# Altium project kypca4_altium.PrjPcb
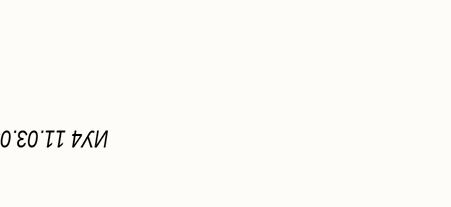
[diagram p0: schema.SchDoc, top left]
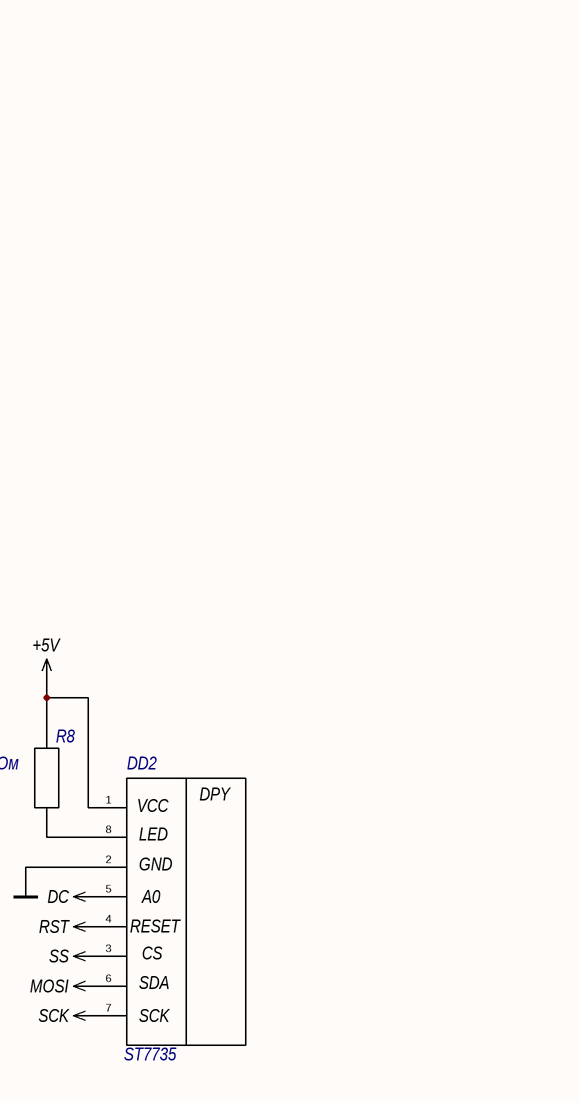
[diagram p1: schema.SchDoc, top right]
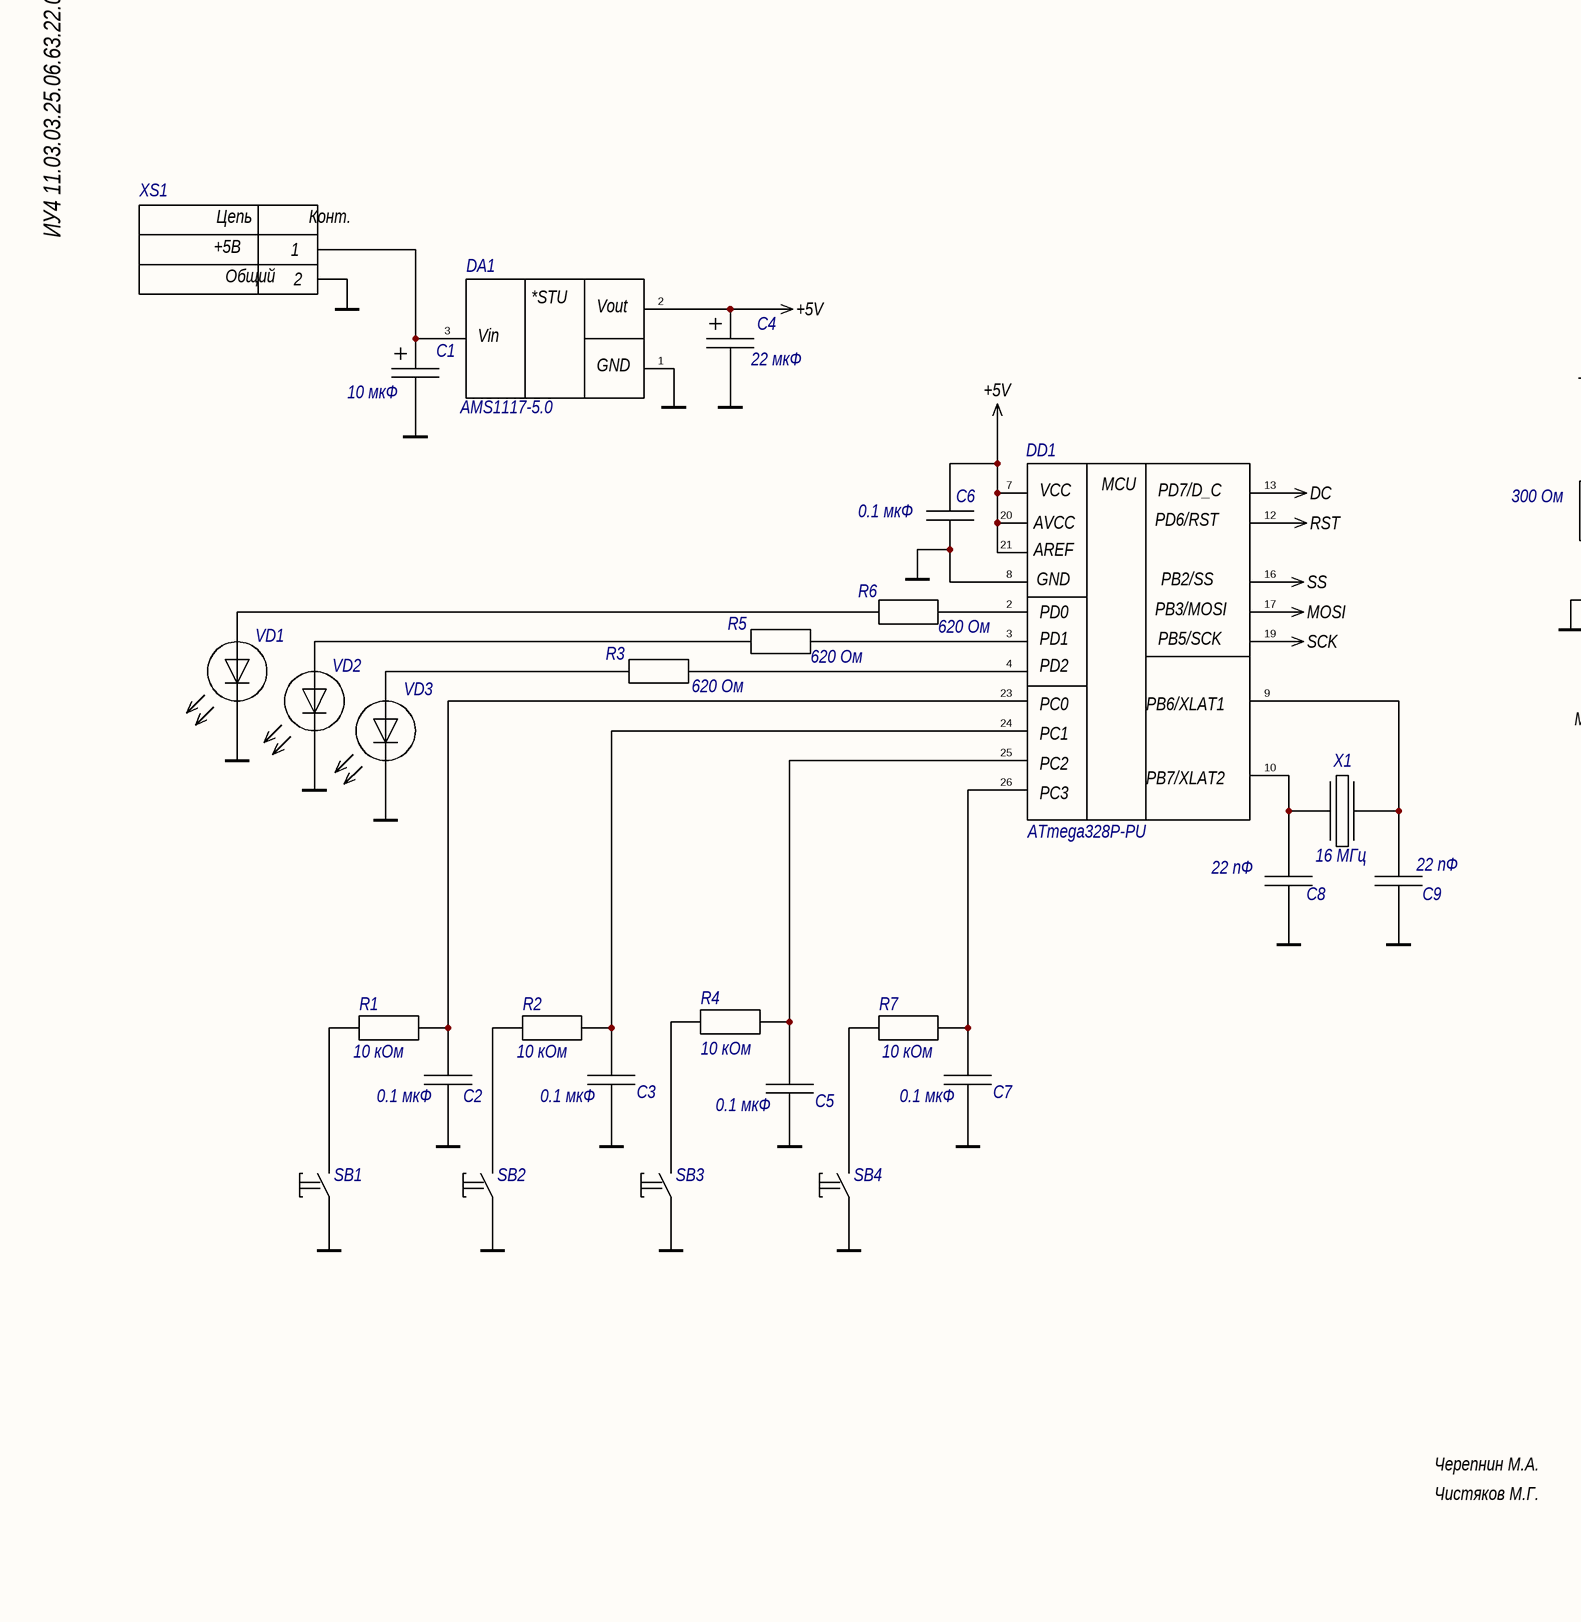
[diagram p2: schema.SchDoc, bottom left]
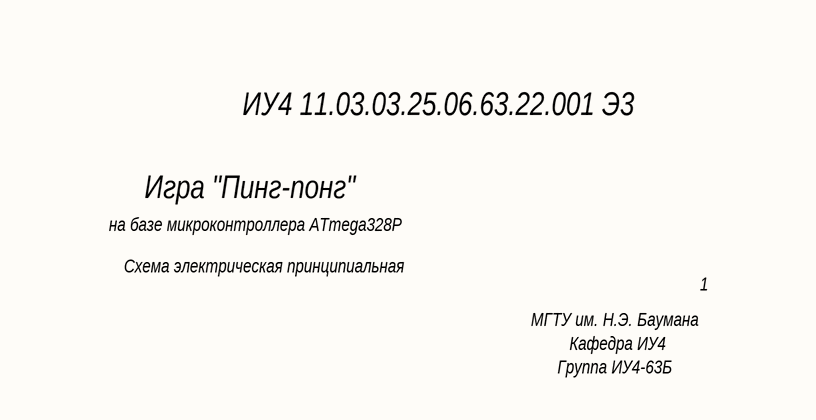
[diagram p3: schema.SchDoc, bottom right]
Папка для сохранения графической документации: Документация; Папка для сохранения текстовой документации: Документация
2 sheets, 29 parts. Net scope: global (net labels, ports and power ports of the same name join across sheets).
Board file: kursa4.PcbDoc
Sheets:
  schema.SchDoc
  E2.SchDoc

## Sheet schema.SchDoc
size 420 x 297 mm; Author: Черепнин М.А.; SheetNumber: 1; SheetTotal: 2

### Parts
C1  10 мкФ  [CE]
C2  0.1 мкФ  [СC]
C3  0.1 мкФ  [СC]
C4  22 мкФ  [CE]
C5  0.1 мкФ  [СC]
C6  0.1 мкФ  [СC]
C7  0.1 мкФ  [СC]
C8  22 пФ  [СC]
C9  22 пФ  [СC]
DA1  AMS1117-5.0  [SOT223]
DD1  ATmega328P-PU  [ATMEGA328P-PU]
DD2  ST7735  [LCD]
R1  10 кОм  [R]
R2  10 кОм  [R]
R3  620 Ом  [R]
R4  10 кОм  [R]
R5  620 Ом  [R]
R6  620 Ом  [R]
R7  10 кОм  [R]
R8  300 Ом  [R]
SB1  Button  [Button]  (value not drawn)
SB2  Button  [Button]  (value not drawn)
SB3  Button  [Button]  (value not drawn)
SB4  Button  [Button]  (value not drawn)
VD1  Led  [LED]  (value not drawn)
VD2  Led  [LED]  (value not drawn)
VD3  Led  [LED]  (value not drawn)
X1  16 МГц  [Quartz]
XS1  USB  [TypeC]  (value not drawn)

### Nets
+5V: C4.1 C6.2 DA1.2 DD1.7 DD1.20 DD1.21 DD2.1 R8.2
DC: DD1.13 DD2.5
GND: C1.2 C2.1 C3.1 C4.2 C5.1 C6.1 C7.1 C8.1 C9.1 DA1.1 DD1.8 DD2.2 SB1.1 SB2.1 SB3.1 SB4.1 VD1.1 VD2.1 VD3.1 XS1.GND
MOSI: DD1.17 DD2.6
RST: DD1.12 DD2.4
SCK: DD1.19 DD2.7
SS: DD1.16 DD2.3
NetC1_1: C1.1 DA1.3 XS1.VCC
NetC2_2: C2.2 DD1.23 R1.2
NetC3_2: C3.2 DD1.24 R2.2
NetC5_2: C5.2 DD1.25 R4.2
NetC7_2: C7.2 DD1.26 R7.2
NetC8_2: C8.2 DD1.10 X1.1
NetC9_2: C9.2 DD1.9 X1.2
NetDD1_2: DD1.2 R6.2
NetDD1_3: DD1.3 R5.2
NetDD1_4: DD1.4 R3.2
NetDD2_8: DD2.8 R8.1
NetR1_1: R1.1 SB1.2
NetR2_1: R2.1 SB2.2
NetR3_1: R3.1 VD3.2
NetR4_1: R4.1 SB3.2
NetR5_1: R5.1 VD2.2
NetR6_1: R6.1 VD1.2
NetR7_1: R7.1 SB4.2

### Notes on the sheet
- ИУ4 11.03.03.25.06.63.22.001 Э3
- ИУ4 11.03.03.25.06.63.22.001
- Игра "Пинг-понг"
- Черепнин М.А.
- Чистяков М.Г.
- на базе микроконтроллера ATmega328P
- Схема электрическая принципиальная
- 1
- МГТУ им. Н.Э. Баумана
- Группа ИУ4-63Б
- Кафедра ИУ4
- Перв.примен.
- Справ.№
- Подп. и дата
- Инв.№ дубл.
- Взам.инв.№
- Подп.и дата
- Разраб.
- Изм.
- Лист
- № докум.
- Подп.
- Дата
- Лит.
- Масштаб
- Масса
- Пров.
- Листов
- Инв.№ подл.
- (in symbol ATmega328P-PU) MCU; VCC; PD7/D_C; AVCC; PD6/RST; AREF; GND; PB2/SS; PD0; PB3/MOSI; PD1; PB5/SCK; PD2; PC0; PB6/XLAT1; PC1; PC2; PB7/XLAT2; PC3
- (in symbol LCD) DPY; VCC; LED; GND; A0; RESET; CS; SDA; SCK
- (in symbol Stabilizator) *STU; Vout; Vin; GND
- (in symbol USB) Цепь; Конт.; +5В; 1; Общий; 2

### Library data of the parts
C1 C4 = CE
C2 C3 C5-C9 = C
DA1 = Stabilizator
DD2 = LCD
R1-R8 = Resistor
VD1-VD3 = Led: RED
X1 = Quartz

## Sheet E2.SchDoc
size 420 x 297 mm; SheetNumber: 2; SheetTotal: 2
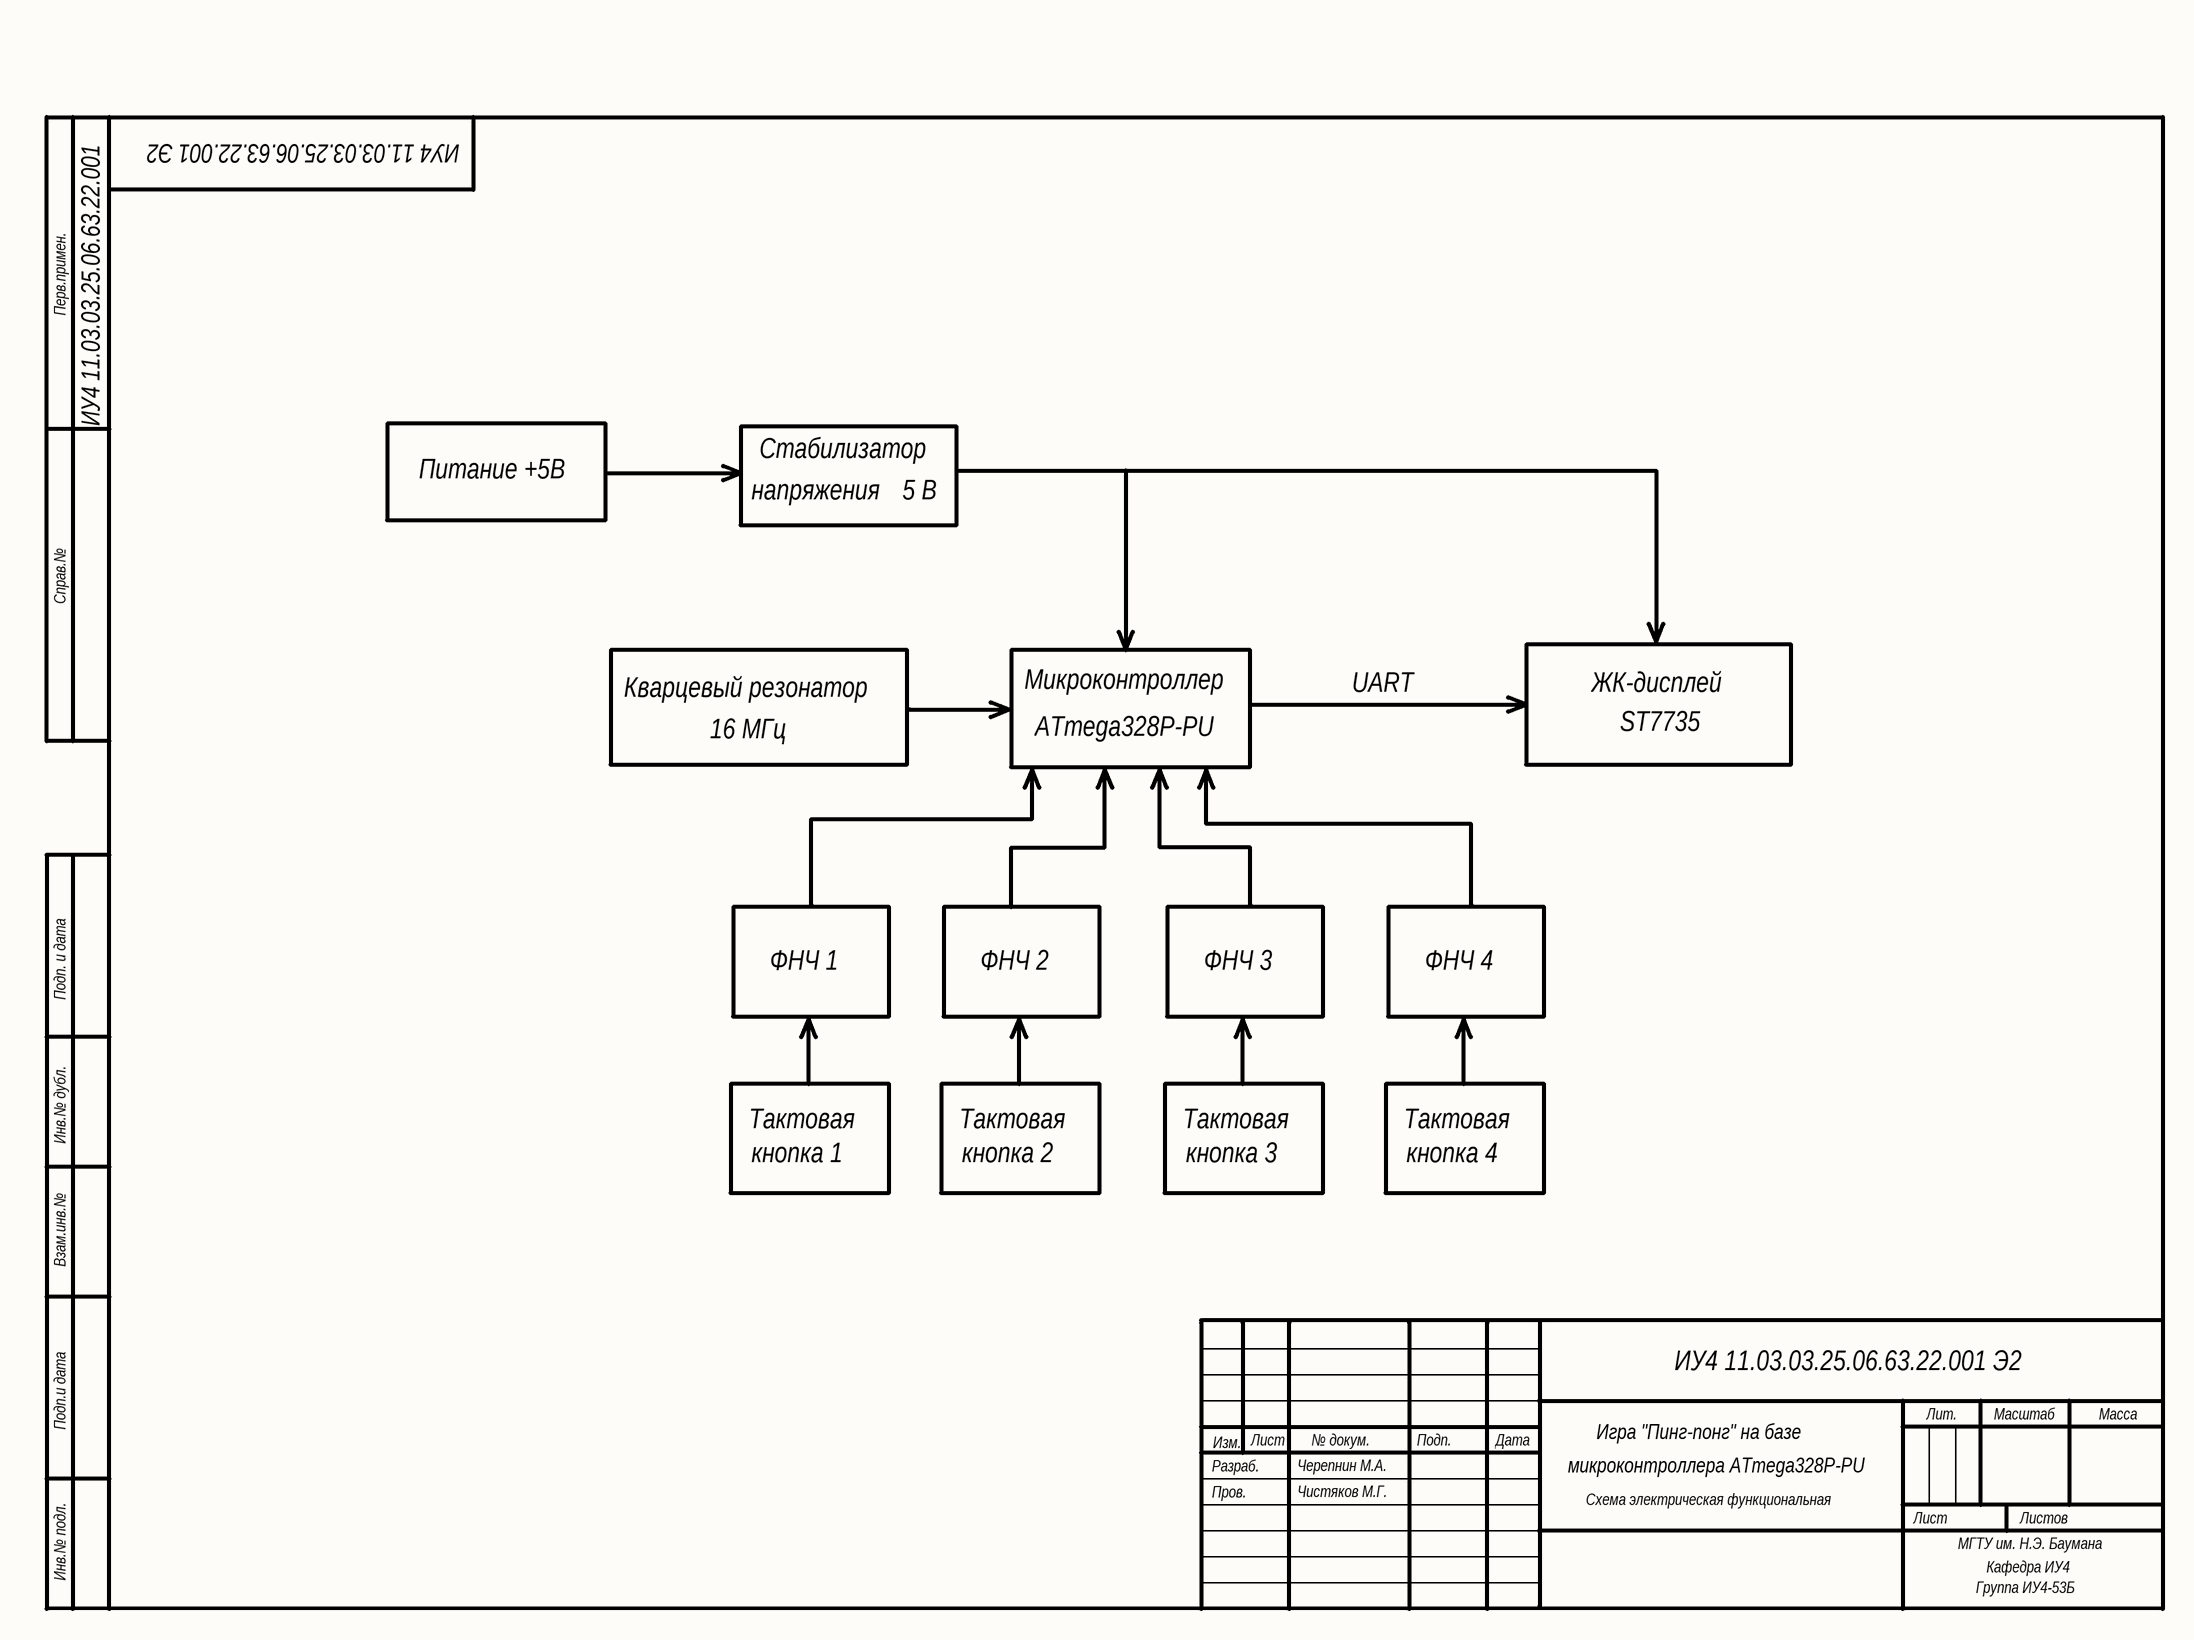
[diagram p4: E2.SchDoc]

### Notes on the sheet
- ИУ4 11.03.03.25.06.63.22.001 Э2
- ИУ4 11.03.03.25.06.63.22.001
- Стабилизатор
- Питание +5В
- напряжения
- 5 В
- Кварцевый резонатор
- Микроконтроллер
- ATmega328P-PU
- UART
- ЖК-дисплей
- ST7735
- 16 МГц
- ФНЧ 1
- ФНЧ 2
- ФНЧ 3
- ФНЧ 4
- Тактовая
- кнопка 1
- кнопка 2
- кнопка 3
- кнопка 4
- Игра "Пинг-понг" на базе
- Черепнин М.А.
- Чистяков М.Г.
- микроконтроллера ATmega328P-PU
- Схема электрическая функциональная
- МГТУ им. Н.Э. Баумана
- Группа ИУ4-53Б
- Кафедра ИУ4
- Перв.примен.
- Справ.№
- Подп. и дата
- Инв.№ дубл.
- Взам.инв.№
- Подп.и дата
- Разраб.
- Изм.
- Лист
- № докум.
- Подп.
- Дата
- Лит.
- Масштаб
- Масса
- Пров.
- Листов
- Инв.№ подл.